# Altium schematic sheet IRsensor_Relayx1_Controller.SchDoc
size A; SheetNumber: 1; SheetTotal: 1
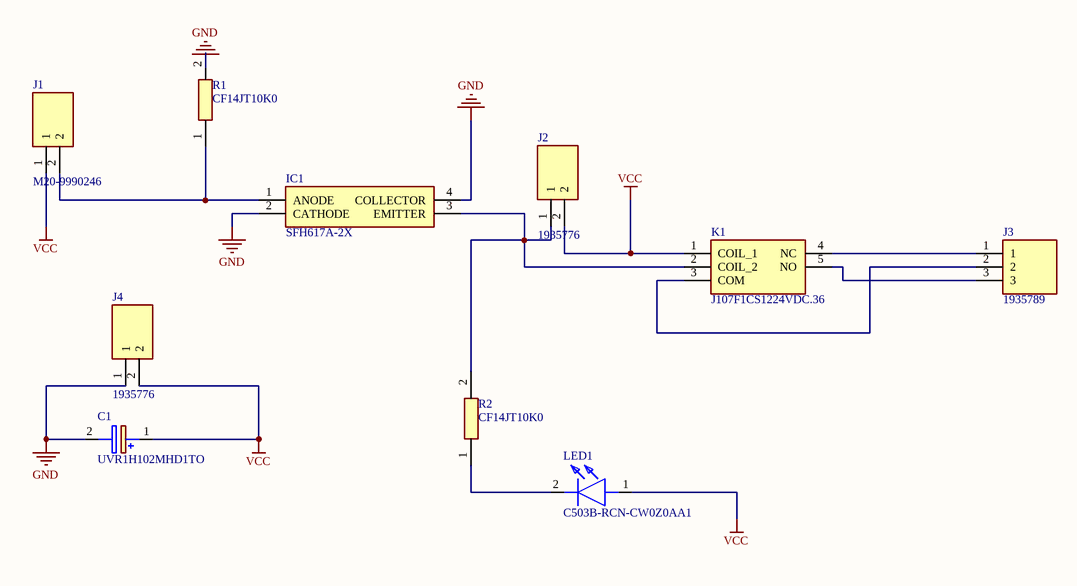
[diagram p0: IRsensor_Relayx1_Controller.SchDoc]

## Parts
C1  UVR1H102MHD1TO  [CAPPRD500W60D1275H2700]
IC1  SFH617A-2X  [DIP762W50P254L458H400Q4N]
J1  M20-9990246  [HDRV2W66P0X254_1X2_508X254X874P]
J2  1935776  [1935776]
J3  1935789  [1935789]
J4  1935776  [1935776]
K1  J107F1CS1224VDC.36  [J107F1CS1224VDC36]
LED1  C503B-RCN-CW0Z0AA1  [C503BRCNCW0Z0AA1]
R1  CF14JT10K0  [RESAD1520W63L600D230]
R2  CF14JT10K0  [RESAD1520W63L600D230]

## Nets
GND: C1.2(-) IC1.2(CATHODE) IC1.4(COLLECTOR) J4.1 R1.2
VCC: C1.1(+) J1.1 J2.2 J4.2 K1.1(COIL_1) LED1.1(A)
NetIC1_1: IC1.1(ANODE) J1.2 R1.1
NetIC1_3: IC1.3(EMITTER) J2.1 K1.2(COIL_2) R2.2
NetJ3_1: J3.1 K1.4(NC)
NetJ3_2: J3.2 K1.3(COM)
NetJ3_3: J3.3 K1.5(NO)
NetLED1_2: LED1.2(K) R2.1

## Library data of the parts
C1 = UVR1H102MHD1TO: Capacitor Polarised; Manufacturer_Name: Nichicon; Datasheet Link: http://nichicon-us.com/english/products/pdfs/e-uvr.pdf; Height: 27mm; Manufacturer_Part_Number: UVR1H102MHD1TO; Mouser Part Number: 647-UVR1H102MHD1T0; Mouser Price/Stock: https://www.mouser.co.uk/ProductDetail/Nichicon/UVR1H102MHD1TO?qs=Wu4QelNNmeNg4t%252BBksLOmQ%3D%3D; Arrow Part Number: UVR1H102MHD1TO; Arrow Price/Stock: https://www.arrow.com/en/products/uvr1h102mhd1to/nichicon
IC1 = SFH617A-2X: Integrated Circuit; Manufacturer_Name: Isocom; Datasheet Link: http://www.farnell.com/datasheets/91023.pdf?_ga=2.50651689.1688980470.1514904698-1411154270.1472651675; Height: 4mm; Manufacturer_Part_Number: SFH617A-2X
J1 = M20-9990246: Connector; Manufacturer_Name: Harwin; Datasheet Link: https://cdn.harwin.com/pdfs/M20-999.pdf; Height: 8.74mm; Manufacturer_Part_Number: M20-9990246; Mouser Part Number: 855-M20-9990246; Mouser Price/Stock: https://www.mouser.co.uk/ProductDetail/Harwin/M20-9990246?qs=Jph8NoUxIfWjw4WmyRvzag%3D%3D
J2 J4 = 1935776: Connector; Manufacturer_Name: Phoenix Contact; Datasheet Link: https://datasheet.datasheetarchive.com/originals/distributors/Datasheets-DGA18/1075322.pdf; Height: 13.5mm; Manufacturer_Part_Number: 1935776; Mouser Part Number: 651-1935776; Mouser Price/Stock: https://www.mouser.co.uk/ProductDetail/Phoenix-Contact/1935776?qs=gjk32EaArKJ3oesOAo3TWA%3D%3D; Arrow Part Number: 1935776; Arrow Price/Stock: https://www.arrow.com/en/products/1935776/phoenix-contact?region=nac
J3 = 1935789: Connector; Manufacturer_Name: Phoenix Contact; Datasheet Link: https://www.phoenixcontact.com/online/portal/us?uri=pxc-oc-itemdetail:pid=1935789&library=usen&tab=1; Height: 13.65mm; Manufacturer_Part_Number: 1935789; Mouser Part Number: 651-1935789; Mouser Price/Stock: https://www.mouser.co.uk/ProductDetail/Phoenix-Contact/1935789?qs=Acf35Ay%2FzLfkp38c%252B1VczQ%3D%3D; Arrow Part Number: 1935789; Arrow Price/Stock: https://www.arrow.com/en/products/1935789/phoenix-contact?region=nac
K1 = J107F1CS1224VDC.36: Relay or Contactor; Manufacturer_Name: CIT; Datasheet Link: https://www.citrelay.com/Catalog%20Pages/RelayCatalog/J107F.pdf; Height: 15.29mm; Manufacturer_Part_Number: J107F1CS1224VDC.36
LED1 = C503B-RCN-CW0Z0AA1: LED; Manufacturer_Name: Cree; Datasheet Link: https://www.cree.com/led-components/media/documents/C503B-RAS-RAN-AAS-AAN-RBS-RBN-ABS-ABN-RCS-RCN-ACS-ACN-1079.pdf; Manufacturer_Part_Number: C503B-RCN-CW0Z0AA1; Mouser Part Number: 941-C503BRCNCW0Z0AA1; Mouser Price/Stock: https://www.mouser.com/Search/Refine.aspx?Keyword=941-C503BRCNCW0Z0AA1; Arrow Part Number: C503B-RCN-CW0Z0AA1; Arrow Price/Stock: https://www.arrow.com/en/products/c503b-rcn-cw0z0aa1/cree
R1 R2 = CF14JT10K0: Resistor; Manufacturer_Name: Stackpole Electronics Inc.; Datasheet Link: https://www.seielect.com/catalog/sei-cf_cfm.pdf; Manufacturer_Part_Number: CF14JT10K0; Arrow Part Number: CF14JT10K0; Arrow Price/Stock: https://www.arrow.com/en/products/cf14jt10k0/stackpole-electronics?region=nac